# EAGLE design AstroEQ DIY Etch (EAGLE 6.6.0)
REVISION: V4.8
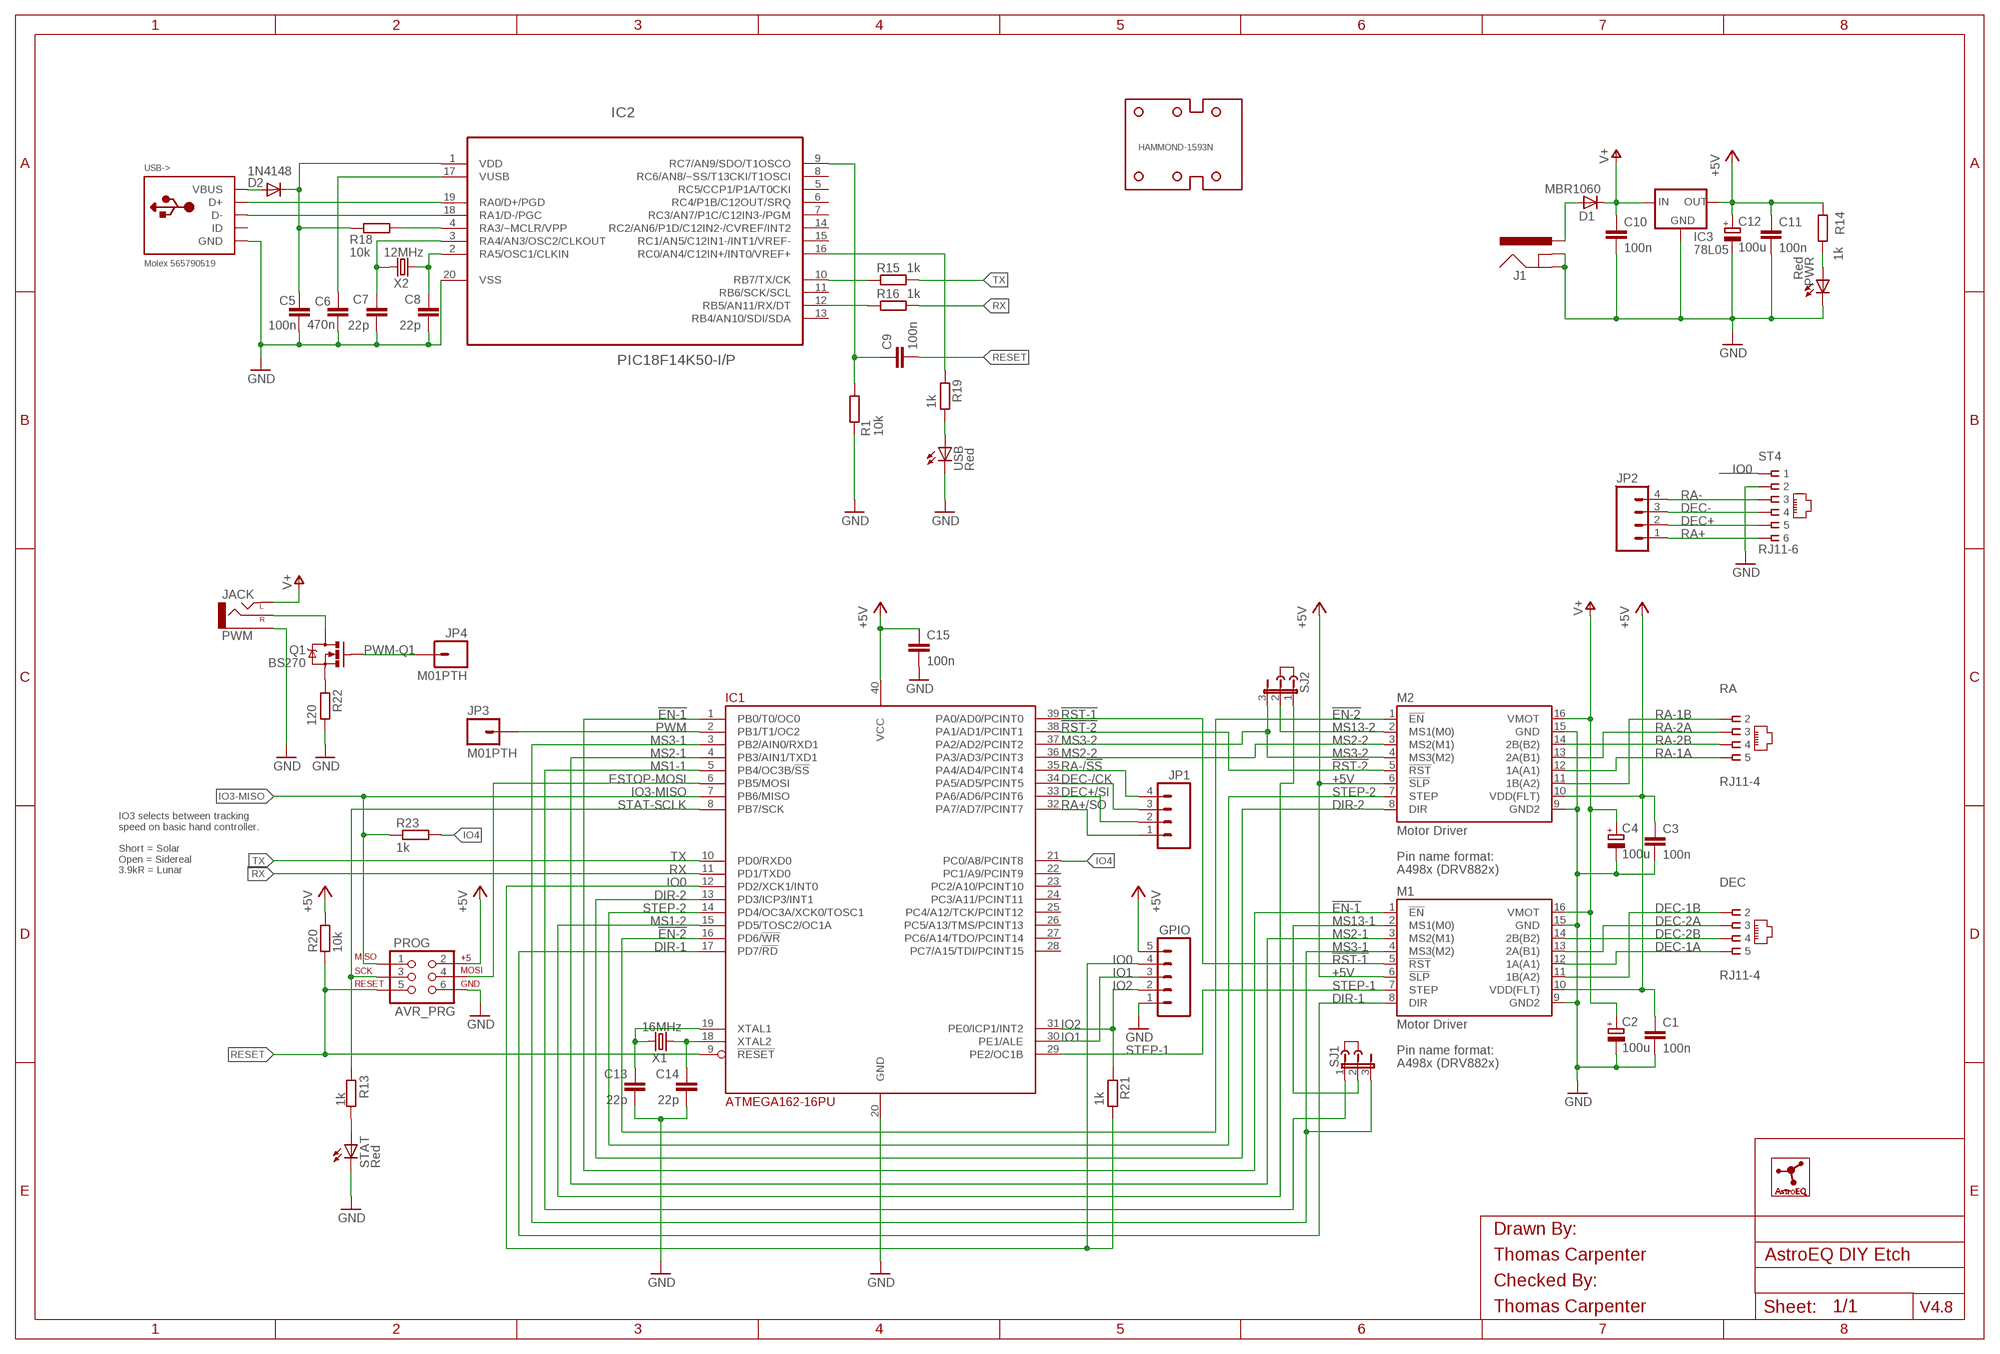
[diagram p0: schematic, sheet 1]
FRAME1 (A3L-LOC): CHECKED_BY: Thomas Carpenter; DRAWN_BY: Thomas Carpenter

## Parts
C1  100n  C-EU025-024X044  [C025-024X044]
C2  100u  CPOL-EUE2.5-7  [E2,5-7]
C3  100n  C-EU025-024X044  [C025-024X044]
C4  100u  CPOL-EUE2.5-7  [E2,5-7]
C5  100n  C-EU025-024X044  [C025-024X044]
C6  470n  C-EU025-024X044  [C025-024X044]
C7  22p  C-EU025-024X044  [C025-024X044]
C8  22p  C-EU025-024X044  [C025-024X044]
C9  100n  C-EU025-024X044  [C025-024X044]
C10  100n  C-EU025-024X044  [C025-024X044]
C11  100n  C-EU025-024X044  [C025-024X044]
C12  100u  CPOL-EUE2.5-7  [E2,5-7]
C13  22p  C-EU025-024X044  [C025-024X044]
C14  22p  C-EU025-024X044  [C025-024X044]
C15  100n  C-EU025-024X044  [C025-024X044]
D1  MBR1060  MUR820  [C221B1A]
D2  1N4148  DIODE1N4148  [DIODE-1N4148]
DEC  RJ11-4  [RJ11-NO_SHIELD-4]
GPIO  M05PTH  [1X05]
HAMMOND-1593N  HAMMOND-1593N-4HOLE  [HAMMOND-1593N4HOLES]
IC1  ATMEGA162-16PU  [DIL40]
IC2  PIC18F14K50-I/P  [DIL20]
IC3  78L05  V_REG_78XXTO-92  [TO-92]
J1  POWER_JACKPTH  [POWER_JACK_PTH]
J2  JUMPER  [JUMP]
J3  JUMPER  [JUMP]
JP1  M04PTH  [1X04]
JP2  M04PTH  [1X04]
JP3  M01PTH  [1X01]
JP4  M01PTH  [1X01]
LOGO1  ASTROEQ5MM  [ASTROEQ-SMALL]
M1  Motor Driver  A4983CARRIER  [DIP16-W]
M2  Motor Driver  A4983CARRIER  [DIP16-W]
PROG  AVR_PRG  AVR_SPI_PRG_6PTH  [2X3]
PWM  JACK  AUDIO-JACKPTH  [AUDIO-JACK]
PWR  Red  LED3MM  [LED3MM]
Q1  BS270  MOSFET-NCHANNELPTH  [TO-92]
R1  10k  R-EU_0204/7  [0204/7]
R13  1k  R-EU_0204/7  [0204/7]
R14  1k  R-EU_0204/7  [0204/7]
R15  1k  R-EU_0204/7  [0204/7]
R16  1k  R-EU_0204/7  [0204/7]
R18  10k  R-EU_0204/7  [0204/7]
R19  1k  R-EU_0204/7  [0204/7]
R20  10k  R-EU_0204/7  [0204/7]
R21  1k  R-EU_0204/7  [0204/7]
R22  120  R-EU_0204/7  [0204/7]
R23  1k  R-EU_0207/10  [0207/10]
RA  RJ11-4  [RJ11-NO_SHIELD-4]
SJ1  JP2EL  [JP2L]
SJ2  JP2EL  [JP2L]
ST4  RJ11-6  RJ11-2L-B  [RJ11-NO_SHIELD]
STAT  Red  LED3MM  [LED3MM]
USB  Red  LED3MM  [LED3MM]
USB->  Molex 565790519  USBMOLEX  [USB-MINIB-THM-MOLEX]
X1  16MHz  CRYSTALHC49US  [HC49US]
X2  12MHz  CRYSTALHC49US  [HC49US]

## Nets
!EN-1: IC1.1(PB0/T0/OC0) M1.1(!EN)
!EN-2: IC1.16(PD6/!WR) M2.1(!EN)
!RST-1: IC1.39(PA0/AD0/PCINT0) M1.5(!RST)
!RST-2: IC1.38(PA1/AD1/PCINT1) M2.5(!RST)
+5V: C1.1 C3.1 C11.1 C12.+ C15.1 GPIO.5 IC1.40(VCC) IC3.1(OUT) M1.6(!SLP) M1.10(VDD(FLT)) M2.6(!SLP) M2.10(VDD(FLT)) PROG.2 R14.1 R20.2
AVROSC1: C13.1 IC1.19(XTAL1) X1.2
AVROSC2: C14.1 IC1.18(XTAL2) X1.1
D+: IC2.19(RA0/D+/PGD) USB->.D+
D-: IC2.18(RA1/D-/PGC) USB->.D-
DEC+: JP2.2 ST4.5
DEC+/SI: IC1.33(PA6/AD6/PCINT6) JP1.2
DEC-: JP2.3 ST4.4
DEC-1A: DEC.5 M1.12(1A(A1))
DEC-1B: DEC.2 M1.11(1B(A2))
DEC-2A: DEC.3 M1.13(2A(B1))
DEC-2B: DEC.4 M1.14(2B(B2))
DEC-/CK: IC1.34(PA5/AD5/PCINT5) JP1.3
DIR-1: IC1.17(PD7/!RD) M1.8(DIR)
DIR-2: IC1.13(PD3/ICP3/INT1) M2.8(DIR)
DTR: C9.1 IC2.9(RC7/AN9/SDO/T1OSCO) R1.1
ESTOP-MOSI: IC1.6(PB5/MOSI) PROG.4
GND: C1.2 C2.- C3.2 C4.- C5.2 C6.1 C7.2 C8.2 C10.2 C11.2 C12.- C13.2 C14.2 C15.2 GPIO.1 IC1.20(GND) IC2.20(VSS) IC3.2(GND) J1.GND J1.GNDBREAK M1.9(GND2) M1.15(GND) M2.9(GND2) M2.15(GND) PROG.6 PWM.SLEEVE PWR.K(C) R1.2 R22.1 ST4.2 STAT.K(C) USB->.GND USB->.GND1(GND) USB->.GND4(GND) USB.K(C)
IO0: GPIO.4 IC1.12(PD2/XCK1/INT0) R21.1 ST4.1
IO1: GPIO.3 IC1.30(PE1/ALE)
IO2: GPIO.2 IC1.31(PE0/ICP1/INT2) R21.2
IO3-MISO: IC1.7(PB6/MISO) PROG.1 R23.1
IO4: IC1.21(PC0/A8/PCINT8) R23.2
MCLR: IC2.4(RA3/~MCLR/VPP) R18.1
MS1-1: IC1.5(PB4/OC3B/!SS) SJ1.1
MS1-2: IC1.15(PD5/TOSC2/OC1A) SJ2.1
MS2-1: IC1.4(PB3/AIN1/TXD1) M1.3(MS2(M1))
MS2-2: IC1.36(PA3/AD3/PCINT3) M2.3(MS2(M1))
MS3-1: IC1.3(PB2/AIN0/RXD1) M1.4(MS3(M2)) SJ1.3
MS3-2: IC1.37(PA2/AD2/PCINT2) M2.4(MS3(M2)) SJ2.3
MS13-1: M1.2(MS1(M0)) SJ1.2
MS13-2: M2.2(MS1(M0)) SJ2.2
PWM: IC1.2(PB1/T1/OC2) JP3.1
PWM-ILIM: Q1.3(S) R22.2
PWM-OUT: PWM.RING(RIGHT) Q1.1(D)
PWM-Q1: JP4.1 Q1.2(G)
PWRLED: PWR.A R14.2
RA+: JP2.1 ST4.6
RA+/SO: IC1.32(PA7/AD7/PCINT7) JP1.1
RA-: JP2.4 ST4.3
RA-1A: M2.12(1A(A1)) RA.5
RA-1B: M2.11(1B(A2)) RA.2
RA-2A: M2.13(2A(B1)) RA.3
RA-2B: M2.14(2B(B2)) RA.4
RA-/!SS: IC1.35(PA4/AD4/PCINT4) JP1.4
RESET: C9.2 IC1.9(!RESET) PROG.5 R20.1
RX: IC1.11(PD1/TXD0) R16.1
RX(USB): IC2.12(RB5/AN11/RX/DT) R16.2
STAT-SCLK: IC1.8(PB7/SCK) PROG.3 R13.1
STATLED: R13.2 STAT.A
STEP-1: IC1.29(PE2/OC1B) M1.7(STEP)
STEP-2: IC1.14(PD4/OC3A/XCK0/TOSC1) M2.7(STEP)
TX: IC1.10(PD0/RXD0) R15.1
TX(USB): IC2.10(RB7/TX/CK) R15.2
USBLED: R19.1 USB.A
USBOSC1: C8.1 IC2.2(RA5/OSC1/CLKIN) X2.1
USBOSC2: C7.1 IC2.3(RA4/AN3/OSC2/CLKOUT) X2.2
USBSTAT: IC2.16(RC0/AN4/C12IN+/INT0/VREF+) R19.2
V+: C2.+ C4.+ C10.1 D1.C IC3.3(IN) M1.16(VMOT) M2.16(VMOT) PWM.TIP(LEFT)
VBUS: D2.A USB->.VBUS
VIN: D1.A J1.PWR
VPIC: C5.1 D2.C IC2.1(VDD) R18.2
VUSB: C6.2 IC2.17(VUSB)
Unconnected: IC1.22(PC1/A9/PCINT9) IC1.23(PC2/A10/PCINT10) IC1.24(PC3/A11/PCINT11) IC1.25(PC4/A12/TCK/PCINT12) IC1.26(PC5/A13/TMS/PCINT13) IC1.27(PC6/A14/TDO/PCINT14) IC1.28(PC7/A15/TDI/PCINT15) IC2.5(RC5/CCP1/P1A/T0CKI) IC2.6(RC4/P1B/C12OUT/SRQ) IC2.7(RC3/AN7/P1C/C12IN3-/PGM) IC2.8(RC6/AN8/~SS/T13CKI/T1OSCI) IC2.11(RB6/SCK/SCL) IC2.13(RB4/AN10/SDI/SDA) IC2.14(RC2/AN6/P1D/C12IN2-/CVREF/INT2) IC2.15(RC1/AN5/C12IN1-/INT1/VREF-) USB->.ID

## Notes on the sheet
- IO3 selects between tracking
  speed on basic hand controller.
  
  Short = Solar
  Open = Sidereal
  3.9kR = Lunar

## Library data of the parts
C1 C3 C5 C9-C11 C15 = resistor:C-EU: CAPACITOR, European symbol; MF: AVX; MPN: SR205C104KAR; OC_FARNELL: 1100367
C2 C4 C12 = resistor:CPOL-EU: POLARIZED CAPACITOR, European symbol; MF: MULTICOMP; MPN: MCGPR25V107M6.3X11; OC_FARNELL: 9451188
C6 = resistor:C-EU: CAPACITOR, European symbol; MF: KEMET; MPN: C320C474M5U5TA; OC_FARNELL: 1457660
C7 C8 C13 C14 = resistor:C-EU: CAPACITOR, European symbol; MF: AVX; MPN: SR151A220JAR; OC_FARNELL: 1100369
D1 = diode:MUR820: DIODE; MF: MULTICOMP; MPN: MBR1060; OC_FARNELL: 1625119
D2 = SparkFun:DIODE: Diode These are standard reverse protection diodes and small signal diodes. SMA package can handle up to about 1A. SOD-323 can handle about 200mA. What the SOD-323 package when ordering, there are some mfgs out there that are 5-pin packages.; MF: MULTICOMP; MPN: 1N4148.; OC_FARNELL: 9565124
DEC RA = con-tycoelectronics:RJ11-4; MF: MOLEX; MPN: 95501-2641; OC_FARNELL: 1560166
GPIO = SparkFun:M05: Header 5 Standard 5-pin 0.1" header. Use with straight break away headers (SKU : PRT-00116), right angle break away headers (PRT-00553), swiss pins (PRT-00743), machine pins (PRT-00117), and female headers (PRT-00115). Molex polarized connector foot print use with SKU : PRT-08230 with associated crimp pins and housings.; MF: CYNERGY3; MPN: SSF211X050; OC_FARNELL: 4249100
HAMMOND-1593N = holes:HAMMOND-1593N; MF: HAMMOND; MPN: 1593NBK; OC_FARNELL: 9287566
IC1 = atmel:ATMEGA162: 8-bit RISC MICROCONTROLLER 16K Bytes internal flash program memory 1K Bytes internal SRAM Upto 64K Bytes optional external memory space 512 Bytes EEPROM Two 8-bit timers Two 16-bit timers Dual programmable serial USARTs Master/Slave serial SPI interface Source: ATMEGA162_DIP40.lbr; MF: ATMEL; MPN: ATMEGA162-16PU; OC_FARNELL: 9171169
IC2 = microchip:PIC18F14K50-I/P: USB Flash Microcontrollers; MF: MICROCHIP; MPN: PIC18F14K50-I/P; OC_FARNELL: 1648501; OC_NEWARK: 77M3103; PACKAGE: DIP-20; SUPPLIER: Microchip
IC3 = SparkFun:V_REG_78XX: Voltage Regulator Standard 7805 5V regulator. IGO (Input Ground Output). Spark Fun Electronics SKU : COM-00107; MF: FAIRCHILD SEMICONDUCTOR; MPN: LM78L05ACZX; OC_FARNELL: 1467367
J1 = SparkFun:POWER_JACK: Power Jack This is the standard 5.5mm barrel jack for power. The PTH is the most common, proven, reliable, footprint. All others are experimental. The Slot footprint only works if the mill layer is transmitted to the PCB fab house so be warned. Spark Fun Electronics SKU : PRT-00119. Mating wall wart : TOL-00298 (and others); MF: MULTICOMP; MPN: MJ-179PH; OC_FARNELL: 1737246
J2 J3 = jumper:JUMPER: JUMPER header; OC_FARNELL: unknown
JP1 JP2 = SparkFun:M04: Header 4 Standard 4-pin 0.1" header. Use with straight break away headers (SKU : PRT-00116), right angle break away headers (PRT-00553), swiss pins (PRT-00743), machine pins (PRT-00117), and female headers (PRT-00115). Molex polarized connector foot print use with SKU : PRT-08231 with associated crimp pins and housings. 1MM SMD Version SKU: PRT-10208; OC_FARNELL: unknown
JP3 JP4 = SparkFun:M01: Header 1 Standard 1-pin 0.1" header. Use with straight break away headers (SKU : PRT-00116), right angle break away headers (PRT-00553), swiss pins (PRT-00743), machine pins (PRT-00117), and female headers (PRT-00115).; OC_FARNELL: unknown
LOGO1 = CompanyLogos:ASTROEQ; OC_FARNELL: unknown
M1 M2 = A4983Carrier:A4983CARRIER; MF: SAMTEC; MPN: CES-116-01-T-S; OC_FARNELL: 1667522
PROG = SparkFun:AVR_SPI_PRG_6: AVR ISP 6 Pin This is the reduced ISP connector for AVR programming. Common on Arduino. This footprint will take up less PCB space and can be used with a 10-pin to 6-pin adapter such as SKU: BOB-08508; MF: TE CONNECTIVITY / AMP; MPN: 826632-3; OC_FARNELL: 3418492
PWM = SparkFun:AUDIO-JACK: 3.5mm Audio Jack Simple 3.5mm common PCB mount audio jack. SKU: PRT-08032; MF: CLIFF ELECTRONIC COMPONENTS; MPN: FC68131; OC_FARNELL: 2518188
PWR STAT USB = led:LED: LED OSRAM: - CHIPLED LG R971, LG N971, LY N971, LG Q971, LY Q971, LO R971, LY R971 LH N974, LH R974 LS Q976, LO Q976, LY Q976 LO Q996 - Hyper CHIPLED LW Q18S LB Q993, LB Q99A, LB R99A - SideLED LS A670, LO A670, LY A670, LG A670, LP A670 LB A673, LV A673, LT A673, LW A673 LH A674 LY A675 LS A676, LA A676, LO A676, LY A676, LW A676 LS A679, LY A679, LG A679 - Hyper Micro SIDELED® LS Y876, LA Y876, LO Y876, LY Y876 LT Y87S - SmartLED LW L88C, LW L88S LB L89C, LB L89S, LG L890 LS L89K, LO L89K, LY L89K LS L896, LA L896, LO L896, LY L896 - TOPLED LS T670, LO T670, LY T670, LG T670, LP T670 LSG T670, LSP T670, LSY T670, LOP T670, LYG T670 LG T671, LOG T671, LSG T671 LB T673, LV T673, LT T673, LW T673 LH T674 LS T676, LA T676, LO T676, LY T676, LB T676, LH T676, LSB T676, LW T676 LB T67C, LV T67C, LT T67C, LS T67K, LO T67K, LY T67K, LW E67C LS E67B, LA E67B, LO E67B, LY E67B, LB E67C, LV E67C, LT E67C LW T67C LS T679, LY T679, LG T679 LS T770, LO T770, LY T770, LG T770, LP T770 LB T773, LV T773, LT T773, LW T773 LH T774 LS E675, LA E675, LY E675, LS T675 LS T776, LA T776, LO T776, LY T776, LB T776 LHGB T686 LT T68C, LB T68C - Hyper Mini TOPLED® LB M676 - Mini TOPLED Santana® LG M470 LS M47K, LO M47K, LY M47K Source: http://www.osram.convergy.de LUXEON: - LUMILED® LXK2-PW12-R00, LXK2-PW12-S00, LXK2-PW14-U00, LXK2-PW14-V00 LXK2-PM12-R00, LXK2-PM12-S00, LXK2-PM14-U00 LXK2-PE12-Q00, LXK2-PE12-R00, LXK2-PE12-S00, LXK2-PE14-T00, LXK2-PE14-U00 LXK2-PB12-K00, LXK2-PB12-L00, LXK2-PB12-M00, LXK2-PB14-N00, LXK2-PB14-P00, LXK2-PB14-Q00 LXK2-PR12-L00, LXK2-PR12-M00, LXK2-PR14-Q00, LXK2-PR14-R00 LXK2-PD12-Q00, LXK2-PD12-R00, LXK2-PD12-S00 LXK2-PH12-R00, LXK2-PH12-S00 LXK2-PL12-P00, LXK2-PL12-Q00, LXK2-PL12-R00 Source: www.luxeon.com KINGBRIGHT: KA-3528ASYC Source: www.kingbright.com; MF: KINGBRIGHT; MPN: L-424HDT; OC_FARNELL: 1142499
Q1 = SparkFun:MOSFET-NCHANNEL; MF: FAIRCHILD SEMICONDUCTOR; MPN: BS270; OC_FARNELL: 1017689
R1 R18 R20 = rcl:R-EU_: RESISTOR, European symbol; MF: MULTICOMP; MPN: MF12 10K; OC_FARNELL: 9342419
R13-R16 R19 R21 R23 = rcl:R-EU_: RESISTOR, European symbol; MF: MULTICOMP; MPN: MF12 1K; OC_FARNELL: 9342400
R22 = rcl:R-EU_: RESISTOR, European symbol; MF: MULTICOMP; MPN: MF12 120R; OC_FARNELL: 9342516
SJ1 SJ2 = jumper:JP2E: JUMPER; OC_FARNELL: unknown
ST4 = con-tycoelectronics:RJ11: CORCOM Modular RJ Jacks No Shield Source: www.tycoelectronics.com .. ENG_DS_1654001_1099_RJ_L_0507.pdf; MF: MOLEX; MPN: 95501-2661; OC_FARNELL: 1536490; OC_NEWARK: 83F4463
USB-> = adafruit:USB: USB Connectors USBMINIB - Surface Mount Female Mini-B USB Connector 4UConnector: 06564 By microbuilder.eu Thru-hole RA Female Mini-B USB Connector 4UConnector: 18732 By ladyada.net; MF: MOLEX; MPN: 565790519; OC_FARNELL: 1125347
X1 = SparkFun:CRYSTAL: Crystals Various standard crystals. Proven footprints. Spark Fun Electronics SKU : COM-00534; MF: TXC; MPN: 9B-16.000MEEJ-B; OC_FARNELL: 1842217
X2 = SparkFun:CRYSTAL: Crystals Various standard crystals. Proven footprints. Spark Fun Electronics SKU : COM-00534; MF: TXC; MPN: 9B-12.000MAAJ-B; OC_FARNELL: 1842203

## Net classes
1 power: width 0.61 mm, drill 0.711 mm, clearance 0.203 mm
2 gnd: width 0.305 mm, drill 0.711 mm, clearance 0.203 mm
3 usbvcc: width 0.508 mm, drill 0.711 mm, clearance 0.203 mm

## Board
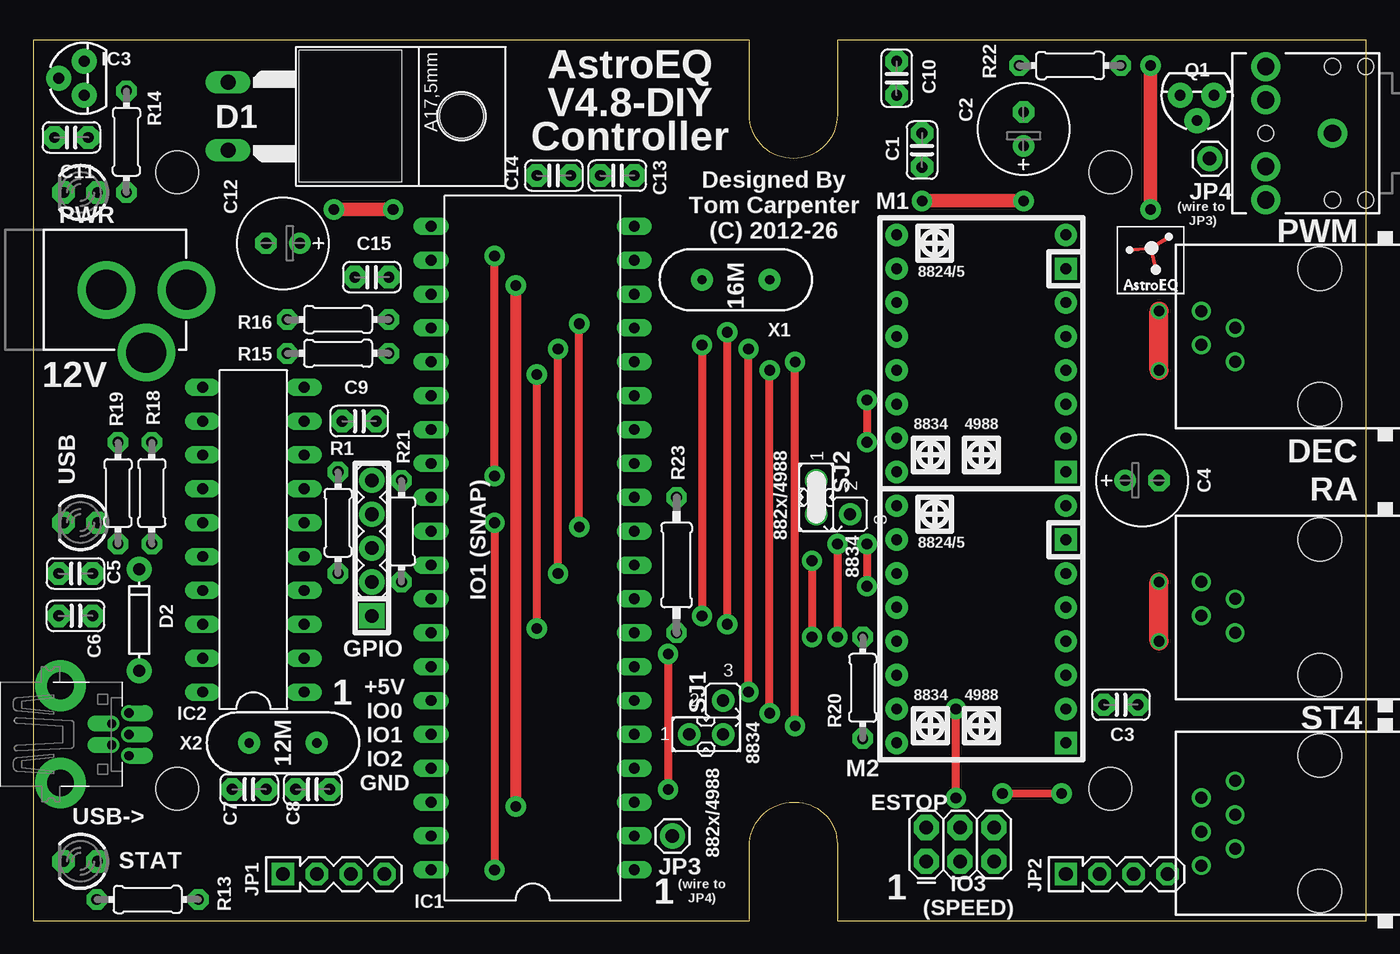
[diagram p1: board, top side]
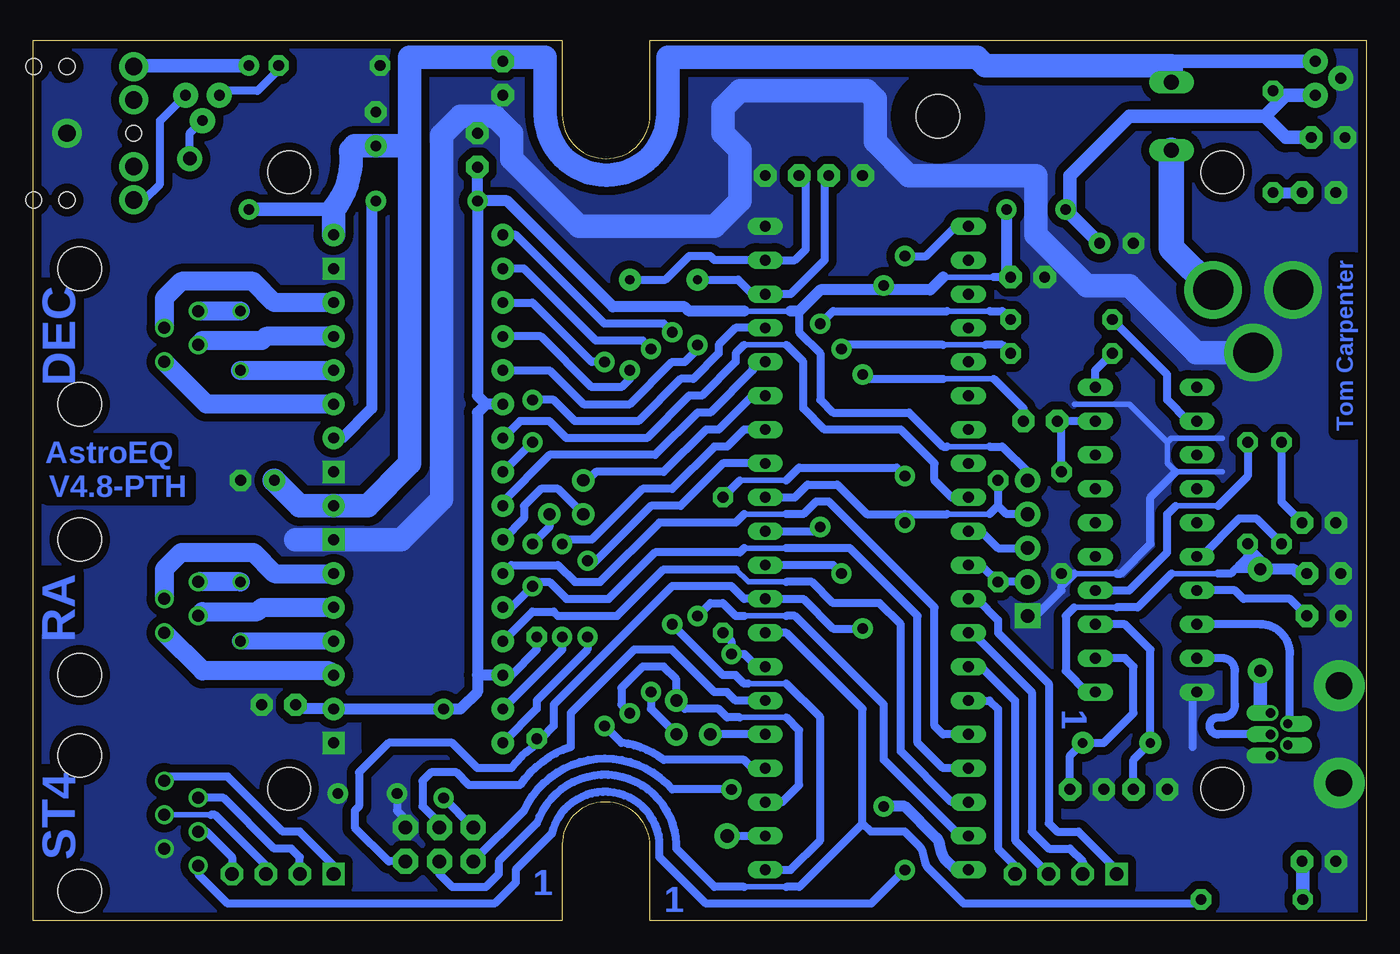
[diagram p2: board, bottom side, seen from below]

Size 100 x 66.04 mm. Coordinates in mm from the lower left corner, seen from the top.
Outline: 57.02,8.89 57.15,8.89
Copper layers (1*16): Top 0.035mm / dielectric 1.5mm / Bottom 0.035mm
Design rules "default *": minimum track width 6mil, minimum drill 12mil, track to track 6mil, track to pad 6mil, pad to pad 6mil, via to via 6mil, smd to smd 0mil, copper to edge 10mil, drill to drill 10mil, minimum pad ring 10mil, minimum via ring 6mil, stop-mask expansion 2mil, vias tented up to drill 1mm, thermal gap 10mil
bKeepout: area 78.3,7.4 to 83.3,12.4; area 78.3,53.6 to 83.3,58.6; area 8.3,7.4 to 13.3,12.4; area 8.3,53.6 to 13.3,58.6
tRestrict: 1 lines
bRestrict: 1 lines

### Footprints (pad centres in the part's own frame; a part is rotated, then mirrored left to right if it is on the bottom)
C025-024X044 = drill 0.813 pad 1.676 octagon: 1 -1.27,0; 2 1.27,0
E2,5-7 = drill 0.813 pad 1.6: + -1.27,0 | drill 0.813 pad 1.6 octagon: - 1.27,0
C221B1A = drill 1.118 long: A 2.54,-6.35; C -2.54,-6.35 | hole 3.302: 0,11.176
DIODE-1N4148 = drill 0.9 pad 1.88: A -3.81,0; C 3.81,0
RJ11-NO_SHIELD-4 = drill 0.9 pad 1.4: 2 -1.905,6.35; 3 -0.635,8.89; 4 0.635,6.35; 5 1.905,8.89 | hole 3.251: -5.08,0; 5.08,0
1X05 = drill 1.016 pad 1.88 square: 1 -5.08,0 | drill 1.016 pad 1.88: 2 -2.54,0; 3 0,0; 4 2.54,0; 5 5.08,0
HAMMOND-1593N4HOLES = hole 3.2: 10.795,9.906; 10.795,56.134; 80.797,9.906; 80.797,56.134
DIL40 = drill 0.813 long: 1 -24.13,-7.62; 2 -21.59,-7.62; 3 -19.05,-7.62; 4 -16.51,-7.62; 5 -13.97,-7.62; 6 -11.43,-7.62; 7 -8.89,-7.62; 8 -6.35,-7.62; 9 -3.81,-7.62; 10 -1.27,-7.62; 11 1.27,-7.62; 12 3.81,-7.62; 13 6.35,-7.62; 14 8.89,-7.62; 15 11.43,-7.62; 16 13.97,-7.62; 17 16.51,-7.62; 18 19.05,-7.62; 19 21.59,-7.62; 20 24.13,-7.62; 21 24.13,7.62; 22 21.59,7.62; 23 19.05,7.62; 24 16.51,7.62; 25 13.97,7.62; 26 11.43,7.62; 27 8.89,7.62; 28 6.35,7.62; 29 3.81,7.62; 30 1.27,7.62; 31 -1.27,7.62; 32 -3.81,7.62; 33 -6.35,7.62; 34 -8.89,7.62; 35 -11.43,7.62; 36 -13.97,7.62; 37 -16.51,7.62; 38 -19.05,7.62; 39 -21.59,7.62; 40 -24.13,7.62
DIL20 = drill 0.813 long: 1 -3.81,11.43; 2 -3.81,8.89; 3 -3.81,6.35; 4 -3.81,3.81; 5 -3.81,1.27; 6 -3.81,-1.27; 7 -3.81,-3.81; 8 -3.81,-6.35; 9 -3.81,-8.89; 10 -3.81,-11.43; 11 3.81,-11.43; 12 3.81,-8.89; 13 3.81,-6.35; 14 3.81,-3.81; 15 3.81,-1.27; 16 3.81,1.27; 17 3.81,3.81; 18 3.81,6.35; 19 3.81,8.89; 20 3.81,11.43
TO-92 = drill 0.813 pad 1.88: 1 -1.27,0; 2 0,1.905; 3 1.27,0
POWER_JACK_PTH = drill 2.997 pad 4.318: GND 0,7.7; GNDBREAK 4.7,10.7; PWR 0,13.7
1X04 = drill 1.016 pad 1.676 square: 1 0,0 | drill 1.016 pad 1.676 octagon: 2 2.54,0; 3 5.08,0; 4 7.62,0
1X01 = drill 1.016 pad 1.88: 1 0,0
DIP16-W = drill 0.813 pad 1.676: 1 -8.89,-6.35; 2 -6.35,-6.35; 3 -3.81,-6.35; 4 -1.27,-6.35; 5 1.27,-6.35; 6 3.81,-6.35; 7 6.35,-6.35; 8 8.89,-6.35; 10 6.35,6.35; 11 3.81,6.35; 12 1.27,6.35; 13 -1.27,6.35; 14 -3.81,6.35; 16 -8.89,6.35 | drill 0.813 pad 1.676 square: 9 8.89,6.35; 15 -6.35,6.35
2X3 = drill 1.016 pad 1.88 octagon: 1 -2.54,-1.27; 2 -2.54,1.27; 3 0,-1.27; 4 0,1.27; 5 2.54,-1.27; 6 2.54,1.27
AUDIO-JACK = drill 1.3 pad 2.184: RING 5,5; RSH 5,2.5; SLEEVE 0,0; TIP 5,-5; TSH 5,-2.5 | hole 1.2: 0,5; -2.5,5; -2.5,-5; 0,-5; 5,0
LED3MM = drill 0.813 pad 1.676 octagon: A -1.27,0; K 1.27,0
0204/7 = drill 0.813 pad 1.524 octagon: 1 -3.81,0; 2 3.81,0
0207/10 = drill 0.813 pad 1.524 octagon: 1 -5.08,0; 2 5.08,0
JP2L = drill 0.914 pad 1.676: 1 -2.54,0; 2 0,0; 3 0,2.54
RJ11-NO_SHIELD = drill 0.9 pad 1.4: 1 -3.175,8.89; 2 -1.905,6.35; 3 -0.635,8.89; 4 0.635,6.35; 5 1.905,8.89; 6 3.175,6.35 | hole 3.251: -5.08,0; 5.08,0
USB-MINIB-THM-MOLEX = drill 0.7 offset: D+ 0,9.72; D- -0.8,8.42; GND 1.6,9.72; ID 0.8,8.42; VBUS -1.6,9.72 | drill 2 pad 3.81: GND1 -3.65,4.57; GND4 3.65,4.57
HC49US = drill 0.7 pad 1.651: 1 -2.54,0; 2 2.54,0

### Placement (x,y rotation side)
C1  66.67,57.78 90 top
C2  74.3,59.37 90 top
C3  81.6,16.19 0 top
C4  83.19,33.02 0 top
C5  3.17,26.04 180 top
C6  3.17,22.86 0 top
C7  16.19,9.84 180 top
C8  20.95,9.84 180 top
C9  24.45,37.47 0 top
C10  64.77,63.18 270 top
C11  2.86,58.74 180 top
C12  18.73,50.8 180 top
C13  43.81,55.88 0 top
C14  39.05,55.88 180 top
C15  25.4,48.26 180 top
D1  20.95,60.33 270 top
D2  7.94,22.54 90 top
DEC  96.52,43.81 90 top
GPIO  25.4,27.94 90 top
HAMMOND-1593N  0,0 0 top
IC1  37.47,27.94 90 top
IC2  16.51,28.57 180 top
IC3  3.81,63.18 90 top
J1  -2.22,47.31 270 top
J2  58.74,31.75 0 top
J3  50.48,13.97 90 top
JP1  18.73,3.49 0 top
JP2  77.47,3.49 0 top
JP3  47.94,6.35 0 top
JP4  88.27,57.15 0 top
LOGO1  81.28,46.99 0 top
M1  71.12,42.55 270 top
M2  71.12,22.23 270 top
PROG  69.53,5.71 0 top
PWM  97.47,59.05 180 top
PWR  3.54,54.61 180 top
Q1  87.31,61.91 180 top
R1  22.86,29.84 270 top
R13  8.57,1.59 180 top
R14  6.99,58.42 270 top
R15  22.86,42.55 180 top
R16  22.86,45.09 180 top
R18  8.89,32.07 270 top
R19  6.35,32.07 270 top
R20  62.23,17.46 90 top
R21  27.62,29.21 270 top
R22  77.79,64.14 0 top
R23  48.26,26.67 90 top
RA  96.52,23.5 90 top
SJ1  51.75,13.97 0 top
SJ2  58.74,30.48 270 top
ST4  96.52,7.3 90 top
STAT  3.54,4.45 180 top
USB  3.54,29.84 180 top
USB->  -2.54,13.97 270 top
X1  52.7,48.07 0 top
X2  18.73,13.34 180 top

### Tracks (layer width: path | path; a pad name or v marks a point on that pad's centre or on a via)
!EN-1  (via drill 0.8 pad 1.52)
  Top 0.61: v52.07,22.23 v52.07,44.13
  Bottom 0.406: 43.5,17.78 46.35,17.78
  Bottom 0.61: IC1.1 43.18,3.81 40.96,6.03 40.96,15.24 43.5,17.78 | 46.35,17.78 46.67,17.78 47.31,18.41 48.26,18.41 v52.07,22.23 | v52.07,44.13 52.7,44.77 57.15,44.77 63.82,51.44 M1.1
!EN-2
  Bottom 0.61: IC1.16 46.04,41.91 46.04,41.27 49.21,38.1 50.16,38.1 53.34,34.92 61.28,34.92 64.77,31.43 M2.1
!RST-1  (via drill 0.8 pad 1.52)
  Top 0.61: v50.16,43.18 v50.16,22.86
  Bottom 0.406: 43.5,22.86 46.67,22.86
  Bottom 0.61: IC1.39 30.48,6.35 36.2,12.06 36.2,16.19 42.86,22.86 43.5,22.86 | M1.5 61.28,41.27 58.74,38.73 55.24,38.73 52.07,41.91 51.12,41.91 50.16,42.86 v50.16,43.18 | v50.16,22.86 49.21,23.81 48.26,23.81 47.31,22.86 46.67,22.86
!RST-2
  Bottom 0.406: 43.5,25.4 46.35,25.4 47.31,26.35
  Bottom 0.61: IC1.38 31.11,8.89 34.92,12.7 34.92,22.23 36.51,23.81 40.01,23.81 41.59,25.4 43.5,25.4 | M2.5 62.55,23.18 60.96,23.18 60.64,22.86 56.2,22.86 52.7,26.35 47.31,26.35
+5V  (via drill 0.8 pad 1.52)
  Top 0.61: v69.22,9.21 v69.22,15.88
  Top 0.813: v36.2,47.62 v36.2,8.57
  Top 1.016: v66.67,53.98 v74.3,53.98 | v22.54,53.34 v26.99,53.34
  Bottom 0.406: 27.94,48.26 31.75,48.26 | 43.18,45.72 46.67,45.72 | 31.43,35.56 28.26,35.56
  Bottom 0.61: 26.99,48.26 27.94,48.26 | PROG.2 v69.22,9.21 | v36.2,47.62 36.2,47.31 | IC1.40 30.8,3.81 | 67.94,15.88 v69.22,15.88 | M2.6 64.14,18.41 62.23,20.32 R20.2 | 42.55,45.72 42.55,44.13 40.96,42.55 40.96,39.05 40.01,38.1 34.29,38.1 31.75,35.56 31.43,35.56 | 28.26,35.56 27.3,35.56 25.4,33.66 GPIO.5
  Bottom 0.813: v66.67,53.98 C1.1 | C15.1 26.99,48.26 v26.99,53.34 | 31.75,48.26 32.7,47.31 36.2,47.31 40.96,47.31 42.55,45.72 43.18,45.72 | 46.67,45.72 50.8,45.72 51.12,46.04 56.52,46.04 64.45,53.98 v66.67,53.98 | 22.23,53.66 22.23,53.34 v22.54,53.34 | 30.8,3.81 31.55,4.57 arc31 31.82,5.03 32,5.76 arc-31 32.26,6.23 34.61,8.57 v36.2,8.57 | v66.67,53.98 66.67,39.37 66.04,38.73 | 66.04,38.73 66.67,38.1 66.67,18.41 | 66.67,18.41 66.67,17.14 67.94,15.88 M2.10 80.01,15.88 C3.1 | M2.6 66.67,18.41 | M1.6 66.04,38.73 | v74.3,53.98 74.61,53.66 74.61,38.42 76.83,36.2 M1.10
  Bottom 1.016: IC3.1 6.03,61.91 6.35,61.59 | 6.35,61.59 7.62,60.33 | 7.62,60.33 17.78,60.33 22.23,55.88 22.23,53.66 22.23,53.02 C12.+ | R14.1 6.35,61.59 | C11.1 6.03,58.74 7.62,60.33
AVROSC1
  Bottom 0.61: C13.1 42.07,55.4 42.07,50.32 42.86,49.53 IC1.19 48.9,49.53 49.21,49.85 50.8,49.85 52.58,48.07 X1.2
AVROSC2
  Bottom 0.61: C14.1 40.64,55.56 40.64,49.53 43.18,46.99 IC1.18 46.04,46.99 47.12,48.07 X1.1
D+
  Bottom 0.61: USB->.D+ 11.11,13.97 arc90 11.75,14.61 arc90 11.11,15.24 10.79,15.24 arc-90 9.84,16.19 9.84,18.73 arc-90 10.79,19.68 IC2.19
D-
  Bottom 0.61: USB->.D- 5.71,14.77 5.71,20 arc-90 7.94,22.23 IC2.18
DEC+
  Bottom 0.61: JP2.2 80.01,4.76 80.64,5.4 81.92,5.4 85.72,9.21 ST4.5
DEC+/SI
  Bottom 0.61: IC1.33 29.53,21.59 25.08,17.14 25.08,6.67 23.81,5.4 22.23,5.4 21.27,4.45 JP1.2
DEC-
  Bottom 0.406: 86.68,7.94 ST4.4
  Bottom 0.61: 86.68,7.94 86.36,7.94 82.55,4.13 JP2.3
DEC-1A  (via drill 0.8)
  Top 1.422: v84.45,41.27 v84.45,45.72
  Bottom 1.422: v84.45,45.72 DEC.5 | v84.45,41.27 M1.12
DEC-1B
  Bottom 1.422: M1.11 87,38.73 DEC.2
DEC-2A
  Bottom 1.422: M1.13 82.55,43.81 82.87,43.5 87.31,43.5 DEC.3
DEC-2B
  Bottom 1.422: M1.14 81.92,46.35 83.5,47.94 88.9,47.94 90.17,46.67 DEC.4
DEC-/CK
  Bottom 0.61: IC1.34 28.89,19.05 26.35,16.51 26.35,6.03 JP1.3
DIR-1  (via drill 0.8 pad 1.52)
  Top 0.61: v62.55,39.05 v62.55,35.88
  Bottom 0.61: IC1.17 47.31,44.45 48.58,43.18 48.58,42.55 50.48,40.64 51.44,40.64 54.61,37.47 59.37,37.47 60.96,39.05 v62.55,39.05 | v62.55,35.88 M1.8
DIR-2  (via drill 0.8 pad 1.52)
  Top 0.61: v58.42,26.99 v58.42,21.27
  Bottom 0.61: IC1.13 48.26,34.29 51.44,31.11 53.66,31.11 58.1,26.67 v58.42,26.99 | v58.42,21.27 58.42,20.32 62.23,16.51 62.23,15.88 M2.8
DTR
  Bottom 0.61: IC2.9 C9.1 22.86,37.47 R1.1
ESTOP-MOSI
  Bottom 0.61: IC1.6 47.31,16.51 47.94,17.14 48.9,17.14 52.07,20.32 54.93,20.32 59.69,15.56 59.69,13.02 arc-37 63.5,10.16 67.31,10.16 68.26,11.11 70.17,11.11 70.8,10.48 70.8,8.57 69.53,7.3 PROG.4
GND  (via drill 0.8 pad 1.52)
  Top 0.61: v77.15,9.53 v72.71,9.53
  Bottom 0.406: 21.91,26.04 18.73,26.04 | 10.79,33.66 14.29,33.66 14.92,34.29 14.92,35.88 | 14.92,35.88 14.61,36.2 10.79,36.2 | 14.92,35.88 17.78,38.73 21.91,38.73
  Bottom 0.61: 13.02,13.02 13.02,16.83 IC2.20 | GPIO.1 24.77,22.86 22.86,24.77 22.86,25.08 | 22.86,25.08 21.91,26.04 R1.2 22.86,25.08 | 18.73,26.04 18.41,26.04 16.19,28.26 16.19,31.75 14.29,33.66 | v72.71,9.53 72.71,8.26 72.07,7.62 PROG.6
  Bottom 1.778: J1.GNDBREAK 12.76,42.61 17.78,47.62 20.95,47.62 24.77,51.44 24.77,55.88 34.29,55.88 36.83,58.42 36.83,61.59 37.47,62.23 46.99,62.23 48.26,60.96 48.26,59.05 46.99,57.78 46.99,53.98 48.9,52.07 59.05,52.07 64.14,57.15 64.14,59.05 65.41,60.33 67.94,60.33 69.37,58.9 69.37,31.59 72.39,28.57 80.33,28.57
  pour Bottom (isolate 0.61, no thermals): -1.27,66.99 101.03,66.99 101.03,-0.95 -1.27,-0.95
IO0  (via drill 0.8 pad 1.52)
  Top 0.61: v34.61,29.84 v34.61,3.81
  Bottom 0.406: 31.43,30.48 28.26,30.48
  Bottom 0.61: IC1.12 42.86,31.75 41.91,32.7 39.69,32.7 37.47,30.48 34.61,30.48 | 34.61,30.48 31.43,30.48 | R21.1 27.62,31.11 | 27.62,31.11 28.26,30.48 | 27.62,31.11 26.99,30.48 GPIO.4 | 34.61,30.48 v34.61,29.84 | ST4.1 87.63,3.49 85.41,1.27 65.41,1.27 63.82,2.86 63.82,3.81 61.12,6.51 arc159 53.02,6.03 53.02,4.76 49.53,1.27 37.15,1.27 v34.61,3.81
IO1
  Bottom 0.61: IC1.30 28.89,29.21 27.62,27.94 GPIO.3
IO2
  Bottom 0.61: IC1.31 28.89,26.67 R21.2 GPIO.2
IO3-MISO  (via drill 0.8 pad 1.52)
  Top 0.61: v47.62,20 v47.62,9.84
  Bottom 0.61: IC1.7 45.72,19.05 46.67,20 v47.62,20 47.62,20.95 R23.1 | PROG.1 63.18,8.26 arc115 52.07,9.84 v47.62,9.84
IO4  (via drill 0.8 pad 1.52)
  Top 0.61: v34.61,33.34 v34.61,49.85
  Bottom 0.406: 46.99,33.02 43.5,33.02
  Bottom 0.61: R23.2 46.99,33.02 | 43.5,33.02 42.55,33.97 35.24,33.97 v34.61,33.34 | v34.61,49.85 33.02,49.85 30.8,52.07 IC1.21
MCLR
  Bottom 0.406: 14.29,31.11 11.11,31.11
  Bottom 0.61: IC2.4 17.78,24.77 14.92,27.62 14.92,30.48 14.29,31.11 | 11.11,31.11 8.89,33.34 R18.1
MS1-1
  Bottom 0.61: IC1.5 SJ1.1
MS1-2
  Bottom 0.61: IC1.15 46.04,39.37 48.58,36.83 49.53,36.83 52.7,33.66 57.78,33.66 58.42,33.02 SJ2.1
MS2-1  (via drill 0.8 pad 1.52)
  Top 0.61: v57.15,14.61 v57.15,41.91
  Bottom 0.61: IC1.4 46.04,11.43 46.67,12.06 52.7,12.06 arc-30 55.88,13.34 v57.15,14.61 | v57.15,41.91 58.1,41.91 62.55,46.35 M1.3
MS2-2
  Bottom 0.406: 43.5,30.48 46.67,30.48
  Bottom 0.61: IC1.36 31.75,13.97 32.38,14.61 32.38,23.5 40.32,31.43 41.27,31.43 42.23,30.48 43.5,30.48 | 46.67,30.48 47.31,29.84 53.02,29.84 57.47,25.4 59.37,25.4 60.64,26.67 64.14,26.67 M2.3
MS3-1  (via drill 0.8 pad 1.52)
  Top 0.61: v55.24,15.56 v55.24,41.27
  Bottom 0.406: 43.5,15.24 46.99,15.24
  Bottom 0.61: M1.4 61.91,43.81 58.1,40.01 55.88,40.01 55.24,40.64 v55.24,41.27 | IC1.3 43.81,8.89 42.55,10.16 42.55,14.29 43.5,15.24 | 46.99,15.24 47.94,15.24 48.58,15.88 51.12,15.88 SJ1.3 51.75,18.1 52.7,19.05 54.29,19.05 55.88,17.46 55.88,16.19 v55.24,15.56
MS3-2  (via drill 0.8 pad 1.52)
  Top 0.61: v62.55,28.26 v62.55,25.08
  Bottom 0.406: 43.5,27.94 46.67,27.94
  Bottom 0.61: IC1.37 31.75,11.43 33.66,13.34 33.66,22.86 38.73,27.94 43.5,27.94 | 46.67,27.94 46.99,27.62 53.34,27.62 56.83,24.13 60.01,24.13 61.28,25.4 62.23,25.4 v62.55,25.08 64.14,23.5 M2.4 | SJ2.3 61.28,29.53 v62.55,28.26
MS13-1  (via drill 0.8 pad 1.52)
  Top 0.61: v53.66,17.14 v53.66,42.86
  Bottom 0.61: v53.66,42.86 54.29,43.5 57.78,43.5 63.18,48.9 M1.2 | v53.66,17.14 53.66,15.88 SJ1.2
MS13-2
  Bottom 0.61: 65.09,28.57 M2.2 63.18,30.16 63.18,31.11 61.91,32.38 60.64,32.38 SJ2.2
PWM
  Bottom 0.61: JP3.1 IC1.2
PWM-ILIM
  Bottom 0.61: R22.2 81.6,63.82 83.19,62.23 85.72,62.23 Q1.3
PWM-OUT
  Bottom 0.61: PWM.RING 91.68,54.05 90.49,55.24 90.49,60.01 Q1.1
PWM-Q1
  Bottom 0.61: JP4.1 88.27,59.05 Q1.2
PWRLED
  Bottom 0.813: R14.2 PWR.A
RA+
  Bottom 0.61: JP2.1 77.15,3.81 80.01,6.67 81.28,6.67 85.41,10.79 89.85,10.79 ST4.6
RA+/SO
  Bottom 0.61: IC1.32 29.21,24.13 27.62,22.54 27.62,21.59 23.81,17.78 23.81,7.3 23.18,6.67 21.59,6.67 18.73,3.81 JP1.1
RA-
  Bottom 0.61: ST4.3 87,6.67 85.09,4.76 JP2.4
RA-1A  (via drill 0.8)
  Top 1.422: v84.45,20.95 v84.45,25.4
  Bottom 1.27: M2.12 v84.45,20.95
  Bottom 1.422: v84.45,25.4 RA.5
RA-1B
  Bottom 1.422: M2.11 77.79,18.73 87.31,18.73 RA.2
RA-2A
  Bottom 1.422: RA.3 87.31,23.18 83.19,23.18 82.87,23.5 M2.13
RA-2B
  Bottom 1.422: M2.14 81.92,26.04 83.5,27.62 88.9,27.62 90.17,26.35 RA.4
RA-/!SS
  Bottom 0.61: IC1.35 28.26,16.51 27.62,15.88 27.62,5.4 26.35,4.13 JP1.4
RESET  (via drill 0.8 pad 1.52)
  Top 0.61: v37.78,21.91 v37.78,40.96
  Bottom 0.406: 31.75,40.64 27.94,40.64
  Bottom 0.61: 61.91,13.65 60.96,14.61 60.96,16.19 52.07,25.08 47.62,25.08 46.67,24.13 IC1.9 42.23,24.13 40.01,21.91 v37.78,21.91 | v37.78,40.96 37.47,40.64 31.75,40.64 | 27.94,40.64 25.72,38.42 C9.2 | R20.1 61.91,13.65 | 61.91,13.65 62.55,13.02 arc-16 64.14,11.43 66.67,11.43 68.58,13.34 73.34,13.34 75.56,11.11 75.56,8.57 75.88,8.26 75.88,6.99 73.34,4.45 PROG.5
RX  (via drill 0.8 pad 1.52)
  Top 0.61: v40.96,29.53 v40.96,44.77
  Bottom 0.406: 31.43,45.72 28.26,45.72
  Bottom 0.61: 31.43,45.72 40.01,45.72 v40.96,44.77 | 28.26,45.72 27.3,45.72 R16.1 | IC1.11 40.96,29.21 v40.96,29.53
RX(USB)
  Bottom 0.61: IC2.12 13.34,37.47 14.92,39.05 14.92,40.96 R16.2
STAT-SCLK
  Bottom 0.406: 43.5,2.54 46.67,2.54
  Bottom 0.61: R13.1 12.7,1.27 30.19,1.27 32.82,3.91 arc31 33.09,4.38 33.27,5.13 arc-31 33.53,5.59 34.61,6.67 37.17,6.67 37.78,7.28 | 37.78,7.28 37.78,15.88 43.5,21.59 IC1.8 | 37.78,7.28 42.52,2.54 43.5,2.54 | PROG.3 69.53,3.49 68.58,2.54 66.04,2.54 65.09,3.49 65.09,4.45 62.23,7.3 arc159 51.75,5.71 51.75,5.4 48.9,2.54 46.67,2.54
STATLED
  Bottom 1.016: STAT.A 4.76,4.49 R13.2
STEP-1
  Bottom 0.406: 43.5,43.18 46.67,43.18
  Bottom 0.61: IC1.29 31.11,31.75 32.38,33.02 32.38,34.29 34.92,36.83 40.64,36.83 42.23,38.42 42.23,41.91 43.5,43.18 | 46.67,43.18 47.31,42.55 47.31,41.91 49.85,39.37 50.8,39.37 53.98,36.2 60.01,36.2 61.28,37.47 63.5,37.47 M1.7
STEP-2  (via drill 0.8 pad 1.52)
  Top 0.61: v60.33,28.26 v60.33,21.27
  Bottom 0.61: IC1.14 46.67,36.83 47.94,35.56 48.9,35.56 52.07,32.38 54.29,32.38 58.1,28.57 60.01,28.57 v60.33,28.26 | v60.33,21.27 60.33,20.32 M2.7
TX  (via drill 0.8 pad 1.52)
  Top 0.61: v39.37,26.04 v39.37,42.86
  Bottom 0.406: 28.57,43.18 31.75,43.18
  Bottom 0.61: v39.37,26.04 40.01,26.67 IC1.10 | R15.1 27.3,43.18 28.57,43.18 | 31.75,43.18 39.05,43.18 v39.37,42.86
TX(USB)
  Bottom 0.61: IC2.10 20.32,41.27 R15.2
USBLED
  Bottom 0.61: USB.A 6.35,31.39 R19.1
USBOSC1
  Bottom 0.61: IC2.2 18.1,19.68 17.46,19.05 17.46,15.56 19.68,13.34 X2.1 22.23,12.38 C8.1
USBOSC2
  Bottom 0.61: IC2.3 18.1,22.23 16.19,20.32 X2.2 17.46,12.06 C7.1
USBSTAT
  Bottom 0.61: IC2.16 12.38,27.3 9.53,30.16 8.26,30.16 R19.2
V+  (via drill 0.8 pad 1.52)
  Top 1.016: v83.82,64.14 v83.82,53.34
  Bottom 0.61: C10.1 64.77,64.77 | D1.C 14.61,63.5 14.61,64.45 14.29,64.45
  Bottom 1.016: IC3.3 14.29,64.45 | v83.82,64.14 92.39,64.14 PWM.TIP | v83.82,53.34 77.47,53.34
  Bottom 1.778: 71.75,58.1 71.75,64.77 64.77,64.77 61.59,64.77 61.59,60.52 arc-180 52.39,60.52 52.39,64.77 29.21,64.77 28.57,64.14 14.61,64.14 14.61,63.5 | 71.75,58.1 C2.+ 75.88,58.1 76.2,57.78 arc45 77.47,53.34 M1.16 | 71.75,58.1 71.75,34.29 74.93,31.11 M2.16 80.01,31.11 C4.+
VBUS
  Bottom 1.016: USB->.VBUS 7.94,15.57 D2.A
VIN
  Bottom 1.93: J1.PWR 14.61,50.44 D1.A
VPIC
  Bottom 0.406: 11.11,26.04 14.61,26.04 | 18.73,23.5 21.91,23.5
  Bottom 0.61: 14.61,26.04 17.14,23.5 18.73,23.5 | 21.91,23.5 22.54,22.86 22.54,18.73 20.95,17.14 IC2.1 | 11.11,26.04 10.16,26.04 9.84,26.35 | D2.C 9.84,26.35 | 9.84,26.35 9.53,26.67 | 8.57,27.62 9.53,26.67 | 9.53,26.67 8.89,26.67 8.26,27.3
  Bottom 0.813: C5.1 5.08,26.04 5.4,26.35 D2.C 7.94,26.99 8.57,27.62 8.89,27.94 R18.2
VUSB
  Bottom 0.61: C6.2 5.71,24.13 9.21,24.13 9.84,24.77 IC2.17

### Text on the board
Bottom: Tom Carpenter | DEC | AstroEQ | V4.8-PTH | RA | 1 | ST4 | 1 | 1
tNames: AstroEQ | V4.8-DIY | Controller | Designed By | Tom Carpenter | (wire to / JP3) | (C) 2012-26 | 16M | 12V | 882x/4988 | IO1 (SNAP) | 8834 | 1 | +5V / IO0 / IO1 / IO2 / GND | 12M | 8834 | ESTOP | 882x/4988 | 1 | 1 | 1 | (wire to / JP4) | IO3 / (SPEED)
tValues: 8824/5 | 8834 | 4988 | 8824/5 | 8834 | 4988 | Markings show the location of the Potentiometers on the | Pololu Boards depending on which chip they use.
Reference: This board design is for those who choose to etch the board at home. | Top Layer not used for DIY Board | Use single-sided copper clad board. Preferably 1oz copper and 1.2mm thick (1.6mm acceptable) | Route RED traces with wires after home Etching. | Make sure to load the ground plane. Type 'ratsnest' and press enter. | When printing silkscreen on paper, only Tnames and Tvalues (and Dimension) layers should be visible. | If using 1.6mm, area around USB connector needs to / be thinned down to 1.2mm thick